# EAGLE design DAWA-IRSENSOR-6.3 (EAGLE 9.5.0)
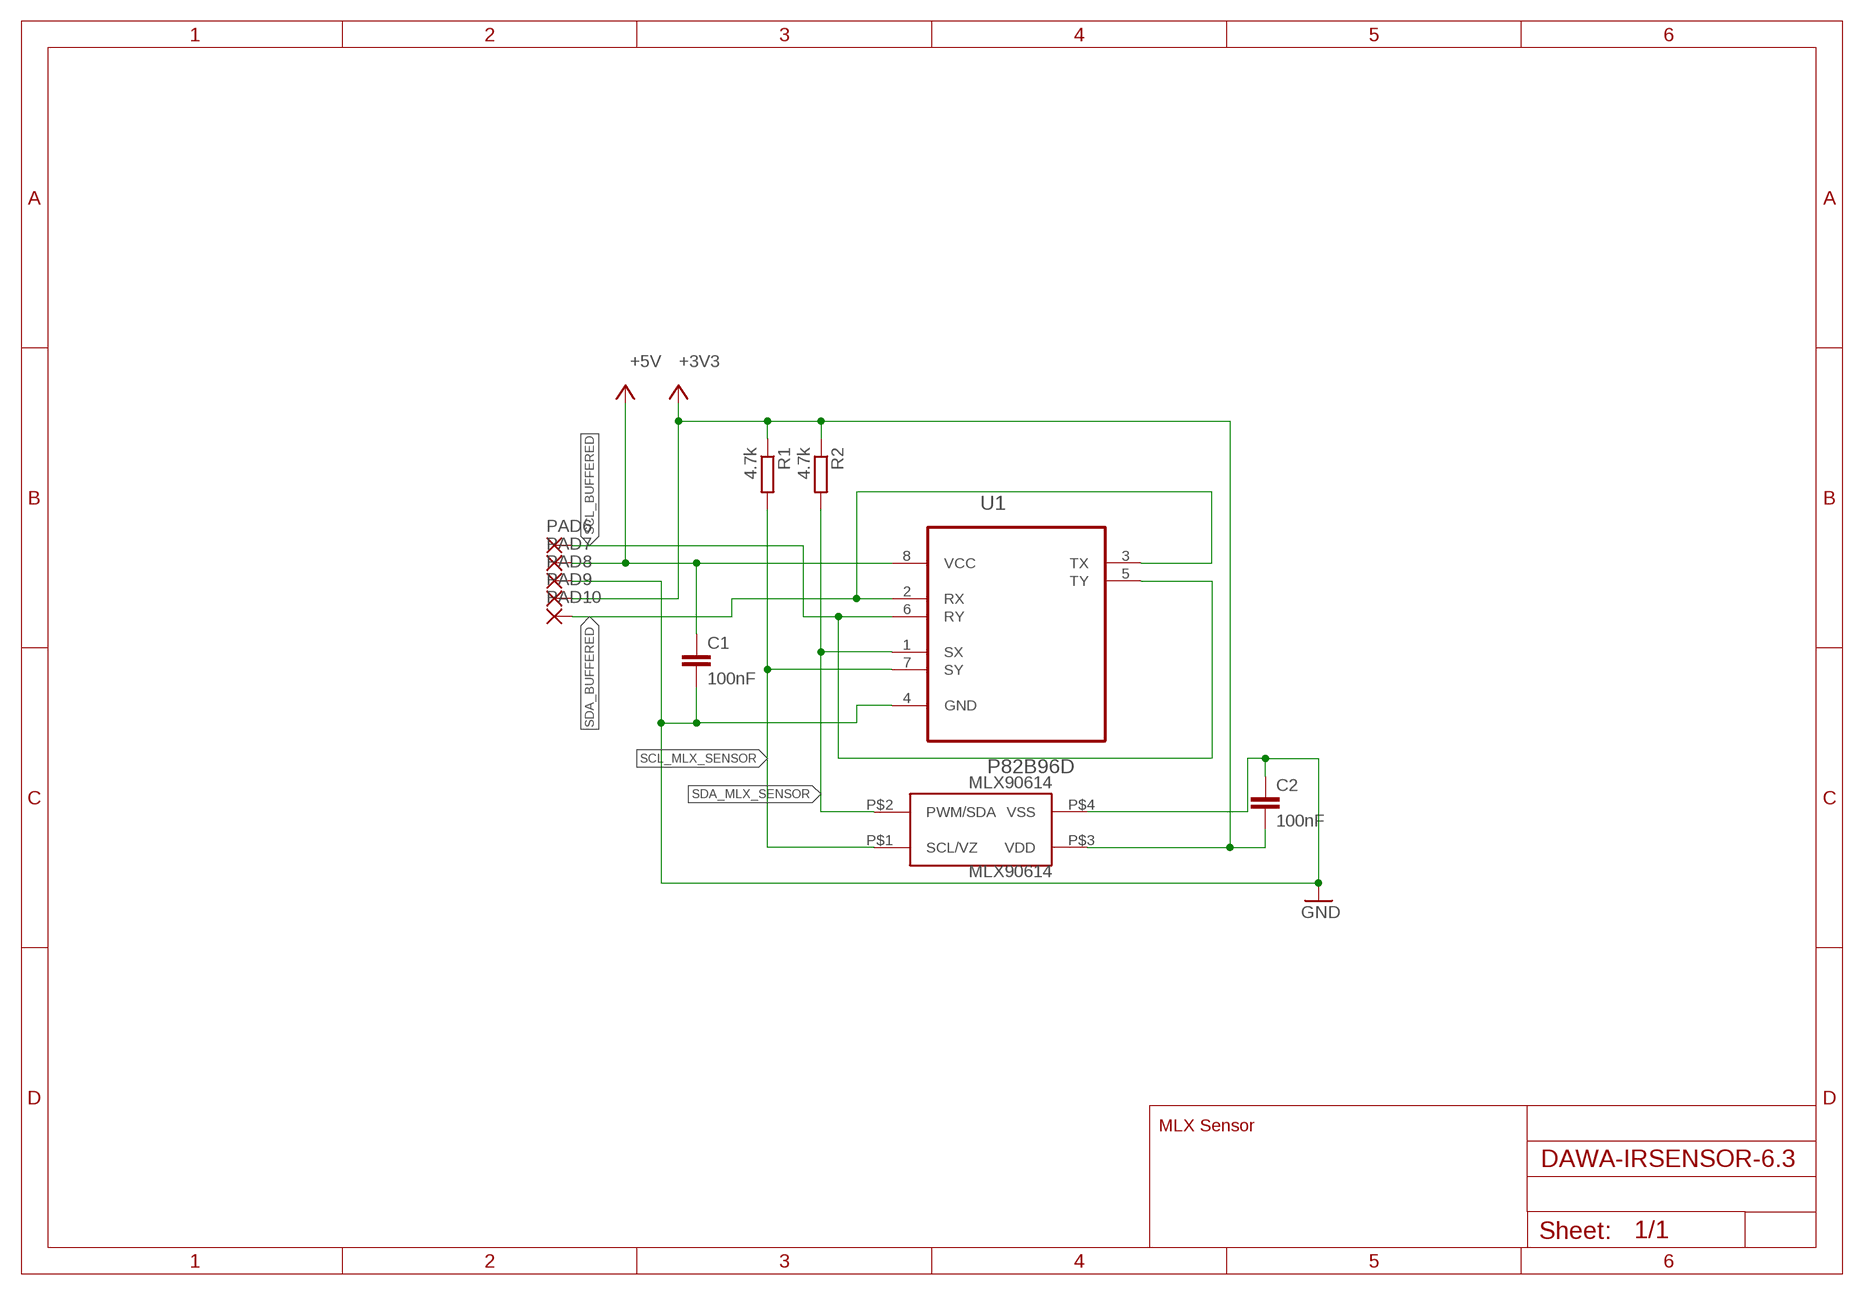
[diagram p0: schematic, sheet 1]

## Parts
C1  100nF  C-EUC0603  [C0603]
C2  100nF  C-EUC0603  [C0603]
MLX90614  MLX90614  MLX90614_  [TO-39]
PAD6  WIREPAD1,6/0,9  [1,6/0,9]
PAD7  WIREPAD1,6/0,9  [1,6/0,9]
PAD8  WIREPAD1,6/0,9  [1,6/0,9]
PAD9  WIREPAD1,6/0,9  [1,6/0,9]
PAD10  WIREPAD1,6/0,9  [1,6/0,9]
R1  4.7k  R-EU_R0603  [R0603]
R2  4.7k  R-EU_R0603  [R0603]
U1  P82B96D  [SOIC127P600X175-8N]

## Nets
+3V3: C2.2 MLX90614.P$3(VDD) PAD9.1(P) R1.1 R2.1
+5V: C1.1 PAD7.1(P) U1.8(VCC)
GND: C1.2 C2.1 MLX90614.P$4(VSS) PAD8.1(P) U1.4(GND)
SCL_BUFFERED: PAD6.1(P) U1.5(TY) U1.6(RY)
SCL_MLX_SENSOR: MLX90614.P$1(SCL/VZ) R1.2 U1.7(SY)
SDA_BUFFERED: PAD10.1(P) U1.2(RX) U1.3(TX)
SDA_MLX_SENSOR: MLX90614.P$2(PWM/SDA) R2.2 U1.1(SX)

## Notes on the sheet
- MLX Sensor

## Library data of the parts
C1 C2 = rcl:C-EU: CAPACITOR, European symbol
MLX90614 = SparkFun-MLX:MLX90614: Melexis IR Thermometer
PAD6-PAD10 = wirepad:WIREPAD: Wire PAD connect wire on PCB
R1 R2 = resistor:R-EU_: RESISTOR, European symbol
U1 = TI:P82B96D: DUAL BIDIRECTIONAL BUS BUFFER; MPN: P82B96D; OC_FARNELL: 1831235; OC_NEWARK: 88K6383; PACKAGE: SOIC-8; SUPPLIER: Texas Instruments

## Net classes
0 default: width 0.203 mm, drill 0.406 mm, clearance 0.203 mm
3 usbvcc: width 0.203 mm, drill 0.406 mm, clearance 0.203 mm
4 USBpair: width 0.254 mm, drill 0.406 mm, clearance 0.61 mm

## Board
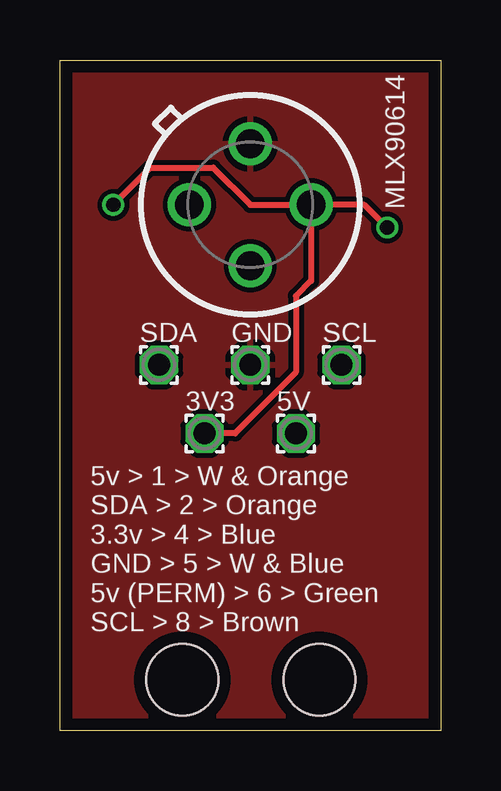
[diagram p1: board, top side]
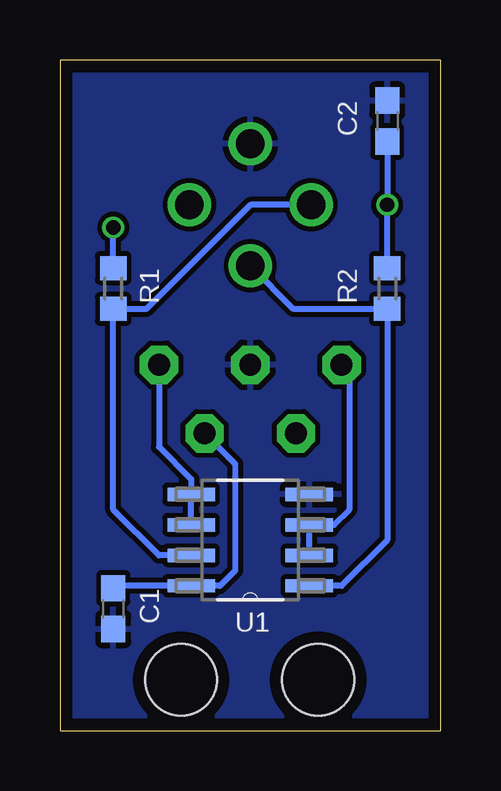
[diagram p2: board, bottom side, seen from below]

Size 15.88 x 27.94 mm. Coordinates in mm from the lower left corner, seen from the top.
Outline: 0,27.94 15.88,27.94 15.88,0 0,0 0,27.94
Copper layers (1*16): Top 0.035mm / dielectric 1.6mm / Bottom 0.035mm
Design rules "Elecrow_2-layer_PCB_eagle_rule *": minimum track width 6mil, minimum drill 12mil, track to track 6mil, track to pad 6mil, pad to pad 6mil, via to via 6mil, smd to smd 0mil, copper to edge 20mil, drill to drill 10mil, minimum pad ring 6mil, minimum via ring 6mil, stop-mask expansion 0mil, vias tented up to drill 100mil, thermal gap 10mil
Holes 3 mm at 5.11,2.12 10.82,2.12

### Footprints (pad centres in the part's own frame; a part is rotated, then mirrored left to right if it is on the bottom)
C0603 = smd 1.1 x 1: 1 -0.85,0; 2 0.85,0
TO-39 = drill 1.2: P$1 2.54,0; P$2 0,2.54; P$3 -2.54,0; P$4 0,-2.54
1,6/0,9 = drill 0.914 pad 1.6 octagon: 1 0,0
R0603 = smd 1 x 1.1: 1 -0.85,0; 2 0.85,0
SOIC127P600X175-8N = smd 1.981 x 0.559: 1 -2.464,1.905; 2 -2.464,0.635; 3 -2.464,-0.635; 4 -2.464,-1.905; 5 2.464,-1.905; 6 2.464,-0.635; 7 2.464,0.635; 8 2.464,1.905

### Placement (x,y rotation side)
C1  13.65,5.08 270 bottom
C2  2.22,25.4 270 bottom
MLX90614  7.94,21.91 180 top
PAD6  11.75,15.24 0 top
PAD7  9.84,12.38 0 top
PAD8  7.94,15.24 0 top
PAD9  6.03,12.38 0 top
PAD10  4.13,15.24 0 top
R1  13.65,18.42 270 bottom
R2  2.22,18.42 270 bottom
U1  7.94,7.94 180 bottom

### Tracks (layer width: path | path; a pad name or v marks a point on that pad's centre or on a via)
+3V3  (via drill 0.6)
  Top 0.254: MLX90614.P$3 10.48,18.73 9.84,18.1 9.84,14.92 7.3,12.38 PAD9.1 | MLX90614.P$3 7.94,21.91 6.39,23.45 3.77,23.45 v2.22,21.91 | v13.65,20.95 12.7,21.91 MLX90614.P$3
  Bottom 0.254: R2.1 v2.22,21.91 C2.2 | R1.1 v13.65,20.95
+5V
  Bottom 0.254: C1.1 13.55,6.03 U1.8 9.21,6.03 8.57,6.67 8.57,11.11 PAD7.1
GND
  pour Bottom: 0,27.94 15.88,27.94 15.88,0 0,0
  pour Top: 0,27.94 15.88,27.94 15.88,0 0,0
SCL_BUFFERED
  Bottom 0.254: U1.6 U1.5 10.4,10.48 11.75,11.82 PAD6.1
SCL_MLX_SENSOR
  Bottom 0.254: MLX90614.P$1 7.94,21.91 12.28,17.56 R1.2 13.65,9.21 11.75,7.3 U1.7
SDA_BUFFERED
  Bottom 0.254: PAD10.1 3.81,14.92 3.81,9.21 4.44,8.57 U1.3 U1.2
SDA_MLX_SENSOR
  Bottom 0.254: MLX90614.P$2 6.13,17.56 R2.2 2.22,7.94 4.13,6.03 U1.1

### Text on the board
tNames: SDA | GND | SCL | 3V3 | 5V | 5v > 1 > W & Orange / SDA > 2 > Orange / 3.3v > 4 > Blue / GND > 5 > W & Blue / 5v (PERM) > 6 > Green / SCL > 8 > Brown